# Altium schematic sheet Inverter.SchDoc
size A4
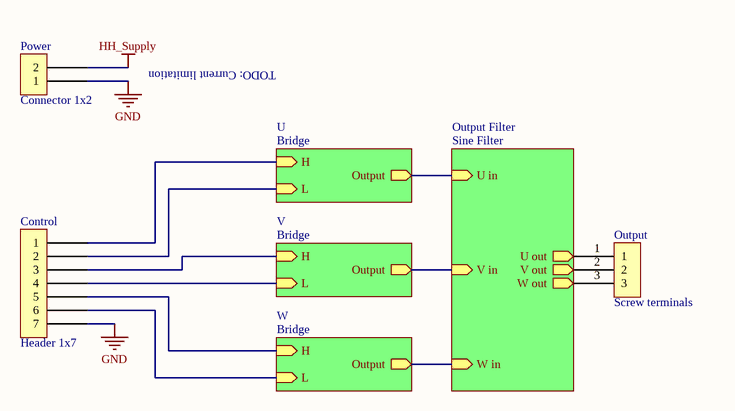
[diagram p0: Inverter.SchDoc]

## Parts
Control  Header 1x7  [Header 1x7]
Output  Screw terminals  [DG301-5.0-03]
Power  Connector 1x2  [DG301-5.0-02]

## Sub-sheets
Output Filter = Sine Filter: W out (out), V out (out), U out (out), W in (in), V in (in), U in (in)
U = Bridge: H (in), L (in), Output (out)
V = Bridge: H (in), L (in), Output (out)
W = Bridge: H (in), L (in), Output (out)

## Nets
GND: Control.7 Power.1
HH_Supply: Power.2
NetControl_1: Control.1 ; sheet U/H
NetControl_2: Control.2 ; sheet U/L
NetControl_3: Control.3 ; sheet V/H
NetControl_4: Control.4 ; sheet V/L
NetControl_5: Control.5 ; sheet W/H
NetControl_6: Control.6 ; sheet W/L
NetOutput_1: Output.1 ; sheet Output Filter/U out
NetOutput_2: Output.2 ; sheet Output Filter/V out
NetOutput_3: Output.3 ; sheet Output Filter/W out
(unnamed): sheet U/Output, sheet Output Filter/U in
(unnamed): sheet V/Output, sheet Output Filter/V in
(unnamed): sheet W/Output, sheet Output Filter/W in

## Notes on the sheet
- TODO: Current limitation

## Library data of the parts
Output = Header 1x3
Power = Header 2x1